# EAGLE design OpenEVSE_PLUS_v2.5 (EAGLE 7.3.0)
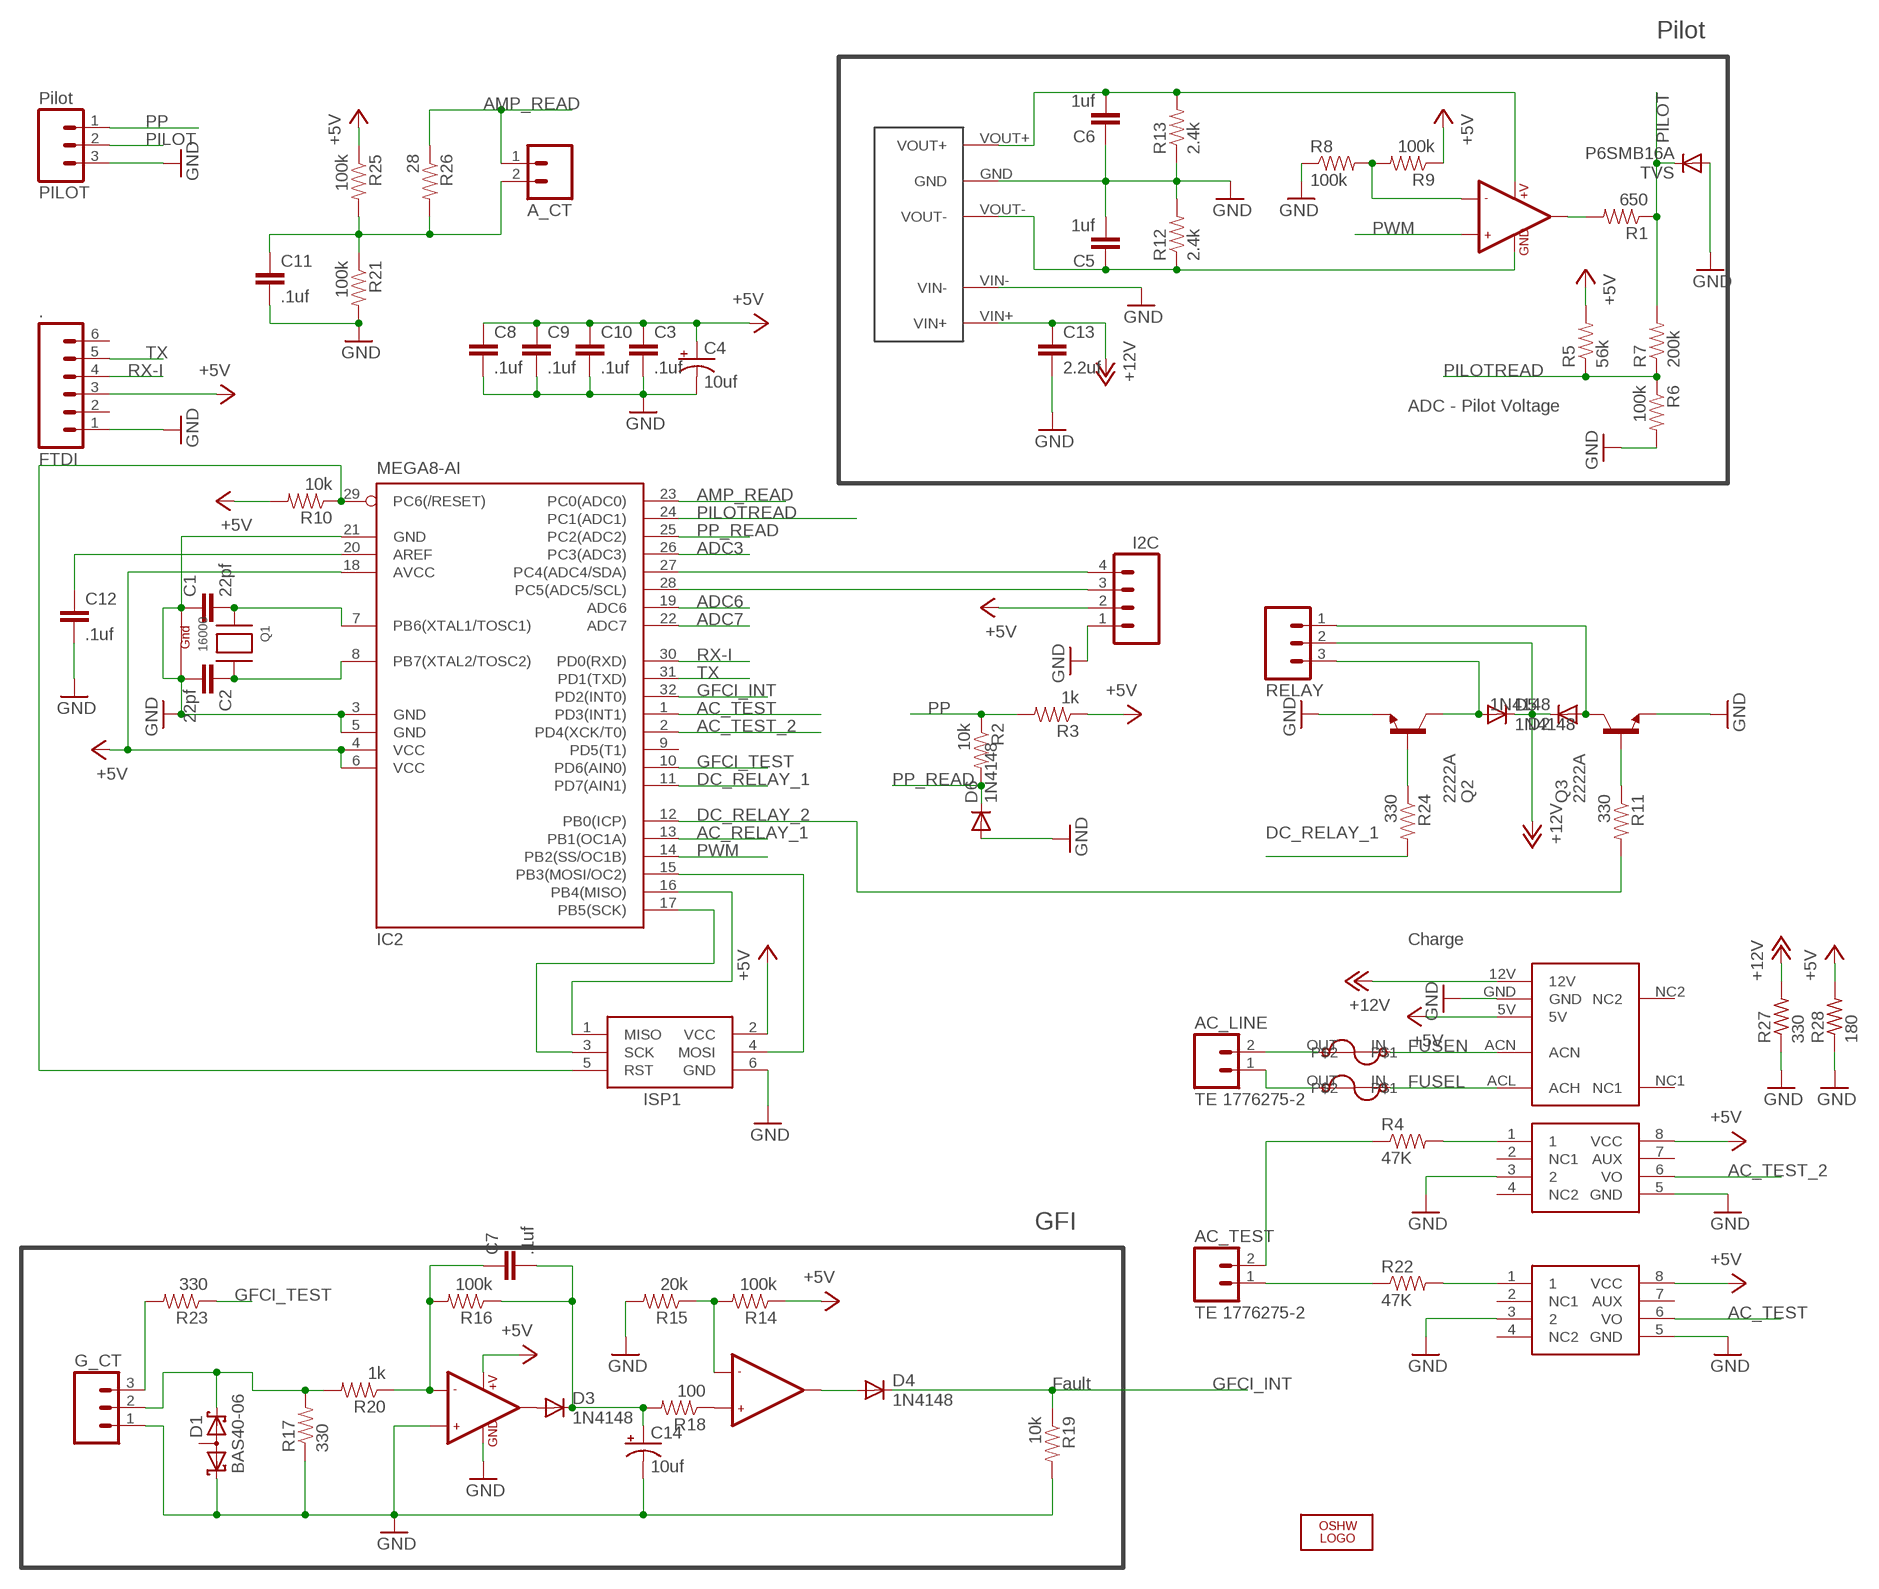
[diagram p0: schematic, sheet 1]

## Parts
.  FTDI  M06LOCK  [1X06_LOCK]
A_CT  M02PTH  [1X02]
AC_LINE  TE 1776275-2  M023.5MM_LOCK  [SCREWTERMINAL-3.5MM-2_LOCK]
AC_TEST  TE 1776275-2  M023.5MM_LOCK  [SCREWTERMINAL-3.5MM-2_LOCK]
C1  22pf  CAP0805  [0805]
C2  22pf  CAP0805  [0805]
C3  .1uf  CAP0805  [0805]
C4  10uf  CAP_POL1206  [EIA3216]
C5  1uf  CAP0805  [0805]
C6  1uf  CAP0805  [0805]
C7  .1uf  CAP0805  [0805]
C8  .1uf  CAP0805  [0805]
C9  .1uf  CAP0805  [0805]
C10  .1uf  CAP0805  [0805]
C11  .1uf  CAP0805  [0805]
C12  .1uf  CAP0805  [0805]
C13  2.2uf  CAP0805  [0805]
C14  10uf  CAP_POL1206  [EIA3216]
D1  BAS40-06  [SOT23]
D2  1N4148  DIODE-SOD123  [SOD123]
D3  1N4148  DIODE-SOD123  [SOD123]
D4  1N4148  DIODE-SOD123  [SOD123]
D5  1N4148  DIODE-SOD123  [SOD123]
D6  1N4148  DIODE-SOD123  [SOD123]
DCDC  D107E  DCDC_SIP  [DCDC_SIP]
F1  BEL1AFUSE  [BELFUSE1A]
F2  BEL1AFUSE  [BELFUSE1A]
G_CT  M03LOCK  [1X03_LOCK]
I2C  M04LOCK  [1X04_LOCK]
IC1  MID400  [DIP08]
IC2  MEGA8-AI  [TQFP32-08]
IC3  LMV358  [SO08]
IC4  LMV358  [SO08]
IC6  MID400  [DIP08]
ISP1  AVRISP-6  [AVRISP]
LOGO1  OSHW_LOGO_8MILX0150-NT  [OSHW_8X150_NOTEXT]
PILOT  Pilot  M03SCREW_LOCK  [SCREWTERMINAL-3.5MM-3_LOCK.007S]
Q1  16000  XTAL-4-3225  [NX3225]
Q2  2222A  BCX70SMD  [SOT23]
Q3  2222A  BCX70SMD  [SOT23]
R1  650  RESISTOR0805-RES  [0805]
R2  10k  RESISTOR0805-RES  [0805]
R3  1k  RESISTOR0805-RES  [0805]
R4  47K  RESISTORPTH-1/4W  [AXIAL-0.4]
R5  56k  RESISTOR0805-RES  [0805]
R6  100k  RESISTOR0805-RES  [0805]
R7  200k  RESISTOR0805-RES  [0805]
R8  100k  RESISTOR0805-RES  [0805]
R9  100k  RESISTOR0805-RES  [0805]
R10  10k  RESISTOR0805-RES  [0805]
R11  330  RESISTOR0805-RES  [0805]
R12  2.4k  RESISTOR0805-RES  [0805]
R13  2.4k  RESISTOR0805-RES  [0805]
R14  100k  RESISTOR0805-RES  [0805]
R15  20k  RESISTOR0805-RES  [0805]
R16  100k  RESISTOR0805-RES  [0805]
R17  330  RESISTOR0805-RES  [0805]
R18  100  RESISTOR0805-RES  [0805]
R19  10k  RESISTOR0805-RES  [0805]
R20  1k  RESISTOR0805-RES  [0805]
R21  100k  RESISTOR0805-RES  [0805]
R22  47K  RESISTORPTH-1/4W  [AXIAL-0.4]
R23  330  RESISTOR0805-RES  [0805]
R24  330  RESISTOR0805-RES  [0805]
R25  100k  RESISTOR0805-RES  [0805]
R26  28  RESISTOR0805-RES  [0805]
R27  330  R-US_R1206  [R1206]
R28  180  R-US_R1206  [R1206]
RELAY  M03SCREW_LOCK  [SCREWTERMINAL-3.5MM-3_LOCK.007S]
TVS  P6SMB16A  DIODE-SMB  [SMB]
U$1  MPM-04E-1205  [MPM-04E-1205]

## Nets
12V: C6.2 DCDC.VOUT+ IC4.8(+V) R13.2
+5V: ..3 C3.1 C4.A(+) C8.1 C9.1 C10.1 I2C.2 IC1.8(VCC) IC2.4(VCC) IC2.6(VCC) IC2.18(AVCC) IC3.8(+V) IC6.8(VCC) ISP1.2(VCC) R3.1 R5.2 R9.1 R10.2 R14.1 R25.1 R28.2 U$1.5V
+12V: C13.1 D2.C D5.C DCDC.VIN+ R27.2 RELAY.2 U$1.12V
-12V: C5.1 DCDC.VOUT- IC4.4(GND) R12.1
AC_RELAY_1: IC2.13(PB1(OC1A))
AC_TEST: IC2.1(PD3(INT1)) IC6.6(VO)
AC_TEST_2: IC1.6(VO) IC2.2(PD4(XCK/T0))
ADC3: IC2.26(PC3(ADC3))
ADC6: IC2.19(ADC6)
ADC7: IC2.22(ADC7)
AMP_READ: A_CT.1 IC2.23(PC0(ADC0)) R26.1
DC_RELAY_1: IC2.11(PD7(AIN1)) R24.2
DC_RELAY_2: IC2.12(PB0(ICP)) R11.2
FUSEL: F2.IN U$1.ACL(ACH)
FUSEN: F1.IN U$1.ACN
GFCI_INT: D4.C IC2.32(PD2(INT0)) R19.1
GFCI_TEST: IC2.10(PD6(AIN0)) R23.1
GND: ..1 C1.1 C2.2 C3.2 C4.C(-) C5.2 C6.1 C8.2 C9.2 C10.2 C11.2 C12.2 C13.2 C14.C(-) D1.1(K1) D6.A DCDC.GND DCDC.VIN- G_CT.1 I2C.1 IC1.3 IC1.5(GND) IC2.3(GND) IC2.5(GND) IC2.21(GND) IC3.3(+IN1) IC3.4(GND) IC6.3 IC6.5(GND) ISP1.6(GND) PILOT.3 Q1.1(G1) Q1.3(G2) Q2.2(E) Q3.2(E) R6.2 R8.1 R12.2 R13.1 R15.2 R17.1 R19.2 R21.2 R27.1 R28.1 TVS.A U$1.GND
N$1: D2.A Q3.3(C) RELAY.1
N$2: Q3.1(B) R11.1
N$4: C1.2 IC2.7(PB6(XTAL1/TOSC1)) Q1.2(X1)
N$5: C2.1 IC2.8(PB7(XTAL2/TOSC2)) Q1.4(X2)
N$6: D5.A Q2.3(C) RELAY.3
N$7: A_CT.2 C11.1 R21.1 R25.2 R26.2
N$8: C7.1 IC3.2(-IN1) R16.2 R20.1
N$9: IC1.1 R4.P$2
N$10: IC4.2(-IN1) R8.2 R9.2
N$11: IC4.1(OUT1) R1.2
N$12: AC_LINE.1 F2.OUT
N$13: AC_LINE.2 F1.OUT
N$14: IC2.15(PB3(MOSI/OC2)) ISP1.4(MOSI)
N$15: IC2.17(PB5(SCK)) ISP1.3(SCK)
N$16: IC2.16(PB4(MISO)) ISP1.1(MISO)
N$17: AC_TEST.2 R4.P$1
N$19: IC6.1 R22.P$2
N$20: D1.2(K2) G_CT.2 R17.2 R20.2
N$21: D3.A IC3.1(OUT1)
N$22: G_CT.3 R23.2
N$23: C7.2 C14.A(+) D3.C R16.1 R18.2
N$24: IC3.6(-IN2) R14.2 R15.1
N$25: D4.A IC3.7(OUT2)
N$26: IC3.5(+IN2) R18.1
N$29: AC_TEST.1 R22.P$1
N$30: Q2.1(B) R24.1
N$39: I2C.4 IC2.27(PC4(ADC4/SDA))
N$40: I2C.3 IC2.28(PC5(ADC5/SCL))
N$44: C12.1 IC2.20(AREF)
PILOT: PILOT.2 R1.1 R7.2 TVS.C
PILOTREAD: IC2.24(PC1(ADC1)) R5.1 R6.1 R7.1
PP: PILOT.1 R2.1 R3.2
PP_READ: D6.C IC2.25(PC2(ADC2)) R2.2
PWM: IC2.14(PB2(SS/OC1B)) IC4.3(+IN1)
RST: IC2.29(PC6(/RESET)) ISP1.5(RST) R10.1
RX-I: ..4 IC2.30(PD0(RXD))
TX: ..5 IC2.31(PD1(TXD))
Unconnected: ..2 ..6 D1.3(AA) IC1.2(NC1) IC1.4(NC2) IC1.7(AUX) IC2.9(PD5(T1)) IC4.5(+IN2) IC4.6(-IN2) IC4.7(OUT2) IC6.2(NC1) IC6.4(NC2) IC6.7(AUX) U$1.NC1 U$1.NC2

## Notes on the sheet
- Pilot
- ADC - Pilot Voltage
- Charge
- GFI
- Fault

## Library data of the parts
. = SparkFun:M06: Header 6 Standard 6-pin 0.1" header. Use with straight break away headers (SKU : PRT-00116), right angle break away headers (PRT-00553), swiss pins (PRT-00743), machine pins (PRT-00117), and female headers (PRT-00115). Molex polarized connector foot print use with SKU : PRT-08094 with associated crimp pins and housings. NOTES ON THE VARIANTS LOCK and LOCK_LONGPADS... This footprint was designed to help hold the alignment of a through-hole component (i.e. 6-pin header) while soldering it into place. You may notice that each hole has been shifted either up or down by 0.005 of an inch from it's more standard position (which is a perfectly straight line). This slight alteration caused the pins (the squares in the middle) to touch the edges of the holes. Because they are alternating, it causes a "brace" to hold the component in place. 0.005 has proven to be the perfect amount of "off-center" position when using our standard breakaway headers. Although looks a little odd when you look at the bare footprint, once you have a header in there, the alteration is very hard to notice. Also, if you push a header all the way into place, it is covered up entirely on the bottom side. This idea of altering the position of holes to aid alignment will be further integrated into the Sparkfun Library for other footprints. It can help hold any component with 3 or more connection pins.
A_CT AC_LINE AC_TEST = SparkFun:M02: Header 2 Standard 2-pin 0.1" header. Use with straight break away headers (SKU : PRT-00116), right angle break away headers (PRT-00553), swiss pins (PRT-00743), machine pins (PRT-00117), and female headers (PRT-00115). Molex polarized connector foot print use with SKU : PRT-08233 with associated crimp pins and housings.
C1-C3 C5-C13 = SparkFun:CAP: Capacitor Standard 0603 ceramic capacitor, and 0.1" leaded capacitor.
C4 C14 = SparkFun:CAP_POL: Capacitor Polarized These are standard SMD and PTH capacitors. Normally 10uF, 47uF, and 100uF in electrolytic and tantalum varieties. Always verify the external diameter of the through hole cap, it varies with capacity, voltage, and manufacturer. The EIA devices should be standard.
D1 = diode:BAS40-06: Silicon Schottky Diodes General-purpose diode for high-speed switching
D2-D6 TVS = diode:DIODE-: DIODE
DCDC = Qxd:DCDC_SIP
F1 F2 = Qxd:BEL1AFUSE
G_CT PILOT RELAY = SparkFun:M03: Header 3 Standard 3-pin 0.1" header. Use with straight break away headers (SKU : PRT-00116), right angle break away headers (PRT-00553), swiss pins (PRT-00743), machine pins (PRT-00117), and female headers (PRT-00115). Molex polarized connector foot print use with SKU : PRT-08232 with associated crimp pins and housings.
I2C = SparkFun:M04: Header 4 Standard 4-pin 0.1" header. Use with straight break away headers (SKU : PRT-00116), right angle break away headers (PRT-00553), swiss pins (PRT-00743), machine pins (PRT-00117), and female headers (PRT-00115). Molex polarized connector foot print use with SKU : PRT-08231 with associated crimp pins and housings.
IC1 IC6 = SparkFun:MID400
IC2 = atmel:MEGA8: MICROCONTROLLER 8 Kbytes FLASH, 1 kbytes SRAM, 512 bytes EEPROM, USART, 6-channel 10 bit ADC, 2-channel 8 bit ADC Pin compatible with Atmega48, ATMega88, ATMega168 Source: avr.lbr; MPN: ATMEGA8-16AU; OC_FARNELL: 9171371; OC_NEWARK: 73M8863
IC3 IC4 = SparkFun:LMV358
ISP1 = adafruit:AVRISP: AVR ISP HEADER Standard 6 pin header for AVR programming
LOGO1 = ohw-logo:OSHW_LOGO_8MIL
Q1 = adafruit:XTAL-4: Classic 4-pin 3.2 x 2.5mm crystal
Q2 Q3 = transistor-npn:BCX70*: NPN Transistor
R1-R26 = SparkFun:RESISTOR: Resistor Basic schematic elements and footprints for 0603, 1206, and PTH resistors.
R27 R28 = rcl:R-US_: RESISTOR, American symbol
U$1 = Qxd:MPM-04E-1205

## Board
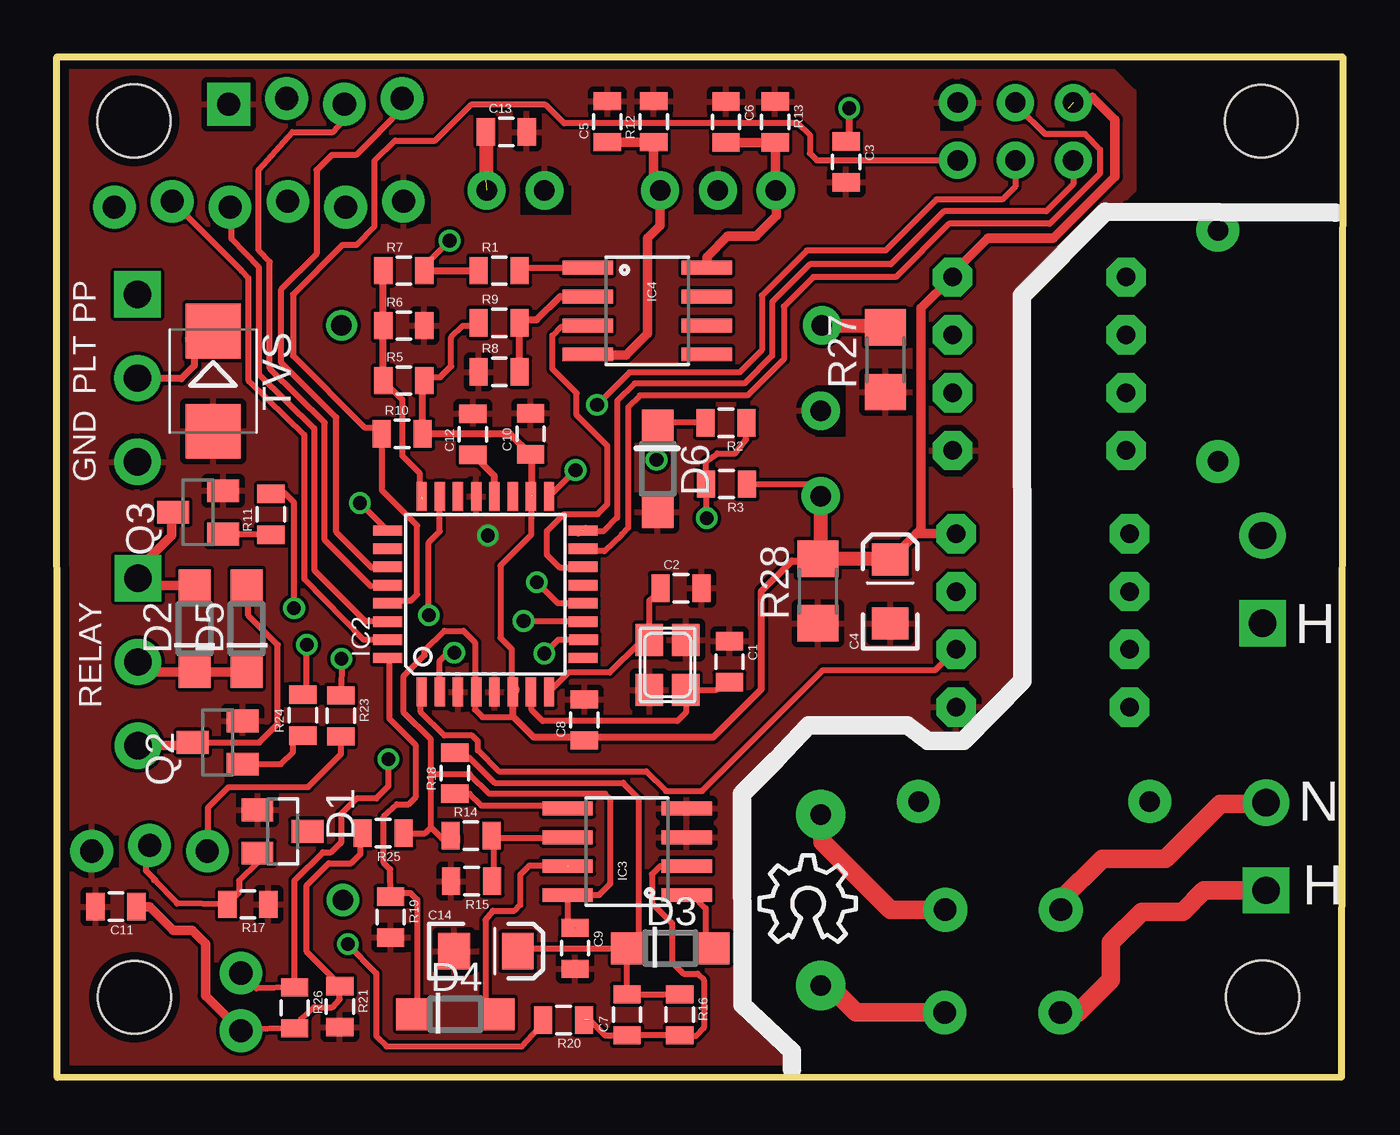
[diagram p1: board, top side]
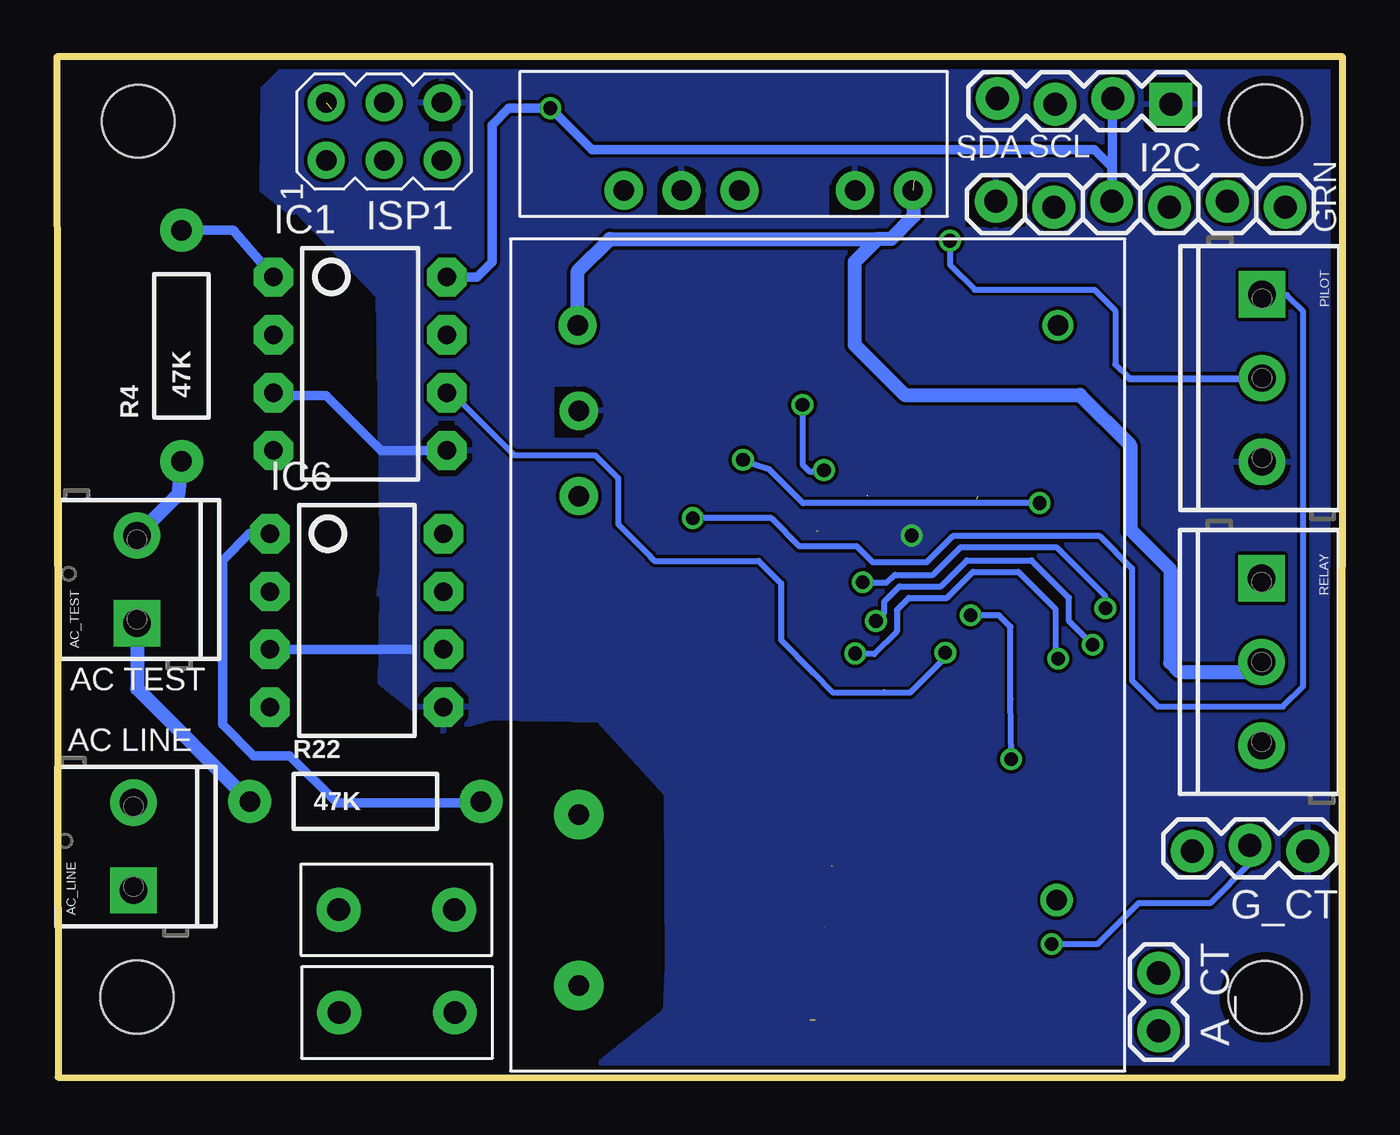
[diagram p2: board, bottom side, seen from below]

Size 56.48 x 44.85 mm. Coordinates in mm from the lower left corner, seen from the top.
Outline: 56.48,44.85 56.43,0.03 0.02,0 0,44.85 56.48,44.85
Copper layers (1*16): Top 0.0356mm / dielectric 1.5011mm / Bottom 0.0356mm
Design rules "default": minimum track width 6mil, minimum drill 13mil, track to track 6mil, track to pad 6mil, pad to pad 6mil, via to via 6mil, smd to smd 6mil, copper to edge 15mil, drill to drill 6mil, minimum pad ring 7mil, minimum via ring 7mil, stop-mask expansion 4mil, vias tented up to drill 0mil, thermal gap 10mil
Holes 3.2 mm at 52.91,42.03 52.97,3.55 3.41,3.53 3.38,42.04
tRestrict: area 38.8,41.6 to 39.8,42.4; area 3.2,25.9 to 3.9,28.3; area 7.2,41.6 to 7.9,43.9; area 39.2,43.2 to 40,43.8; area 39.1,16.2 to 39.8,16.9; area 39.1,16.8 to 40.1,17.4; area 1.8,9.2 to 2.7,10.6; area 14,37.5 to 16.4,38.7; area 20.4,37.9 to 22.6,39.2; area 28,37.9 to 30.1,39.2; area 33.3,28.2 to 34.7,30.4; area 39,27.9 to 39.8,28.7; 1 more areas
bRestrict: area 39.1,41.6 to 40.1,42.3; area 3.2,25.9 to 3.9,28.3; area 7.2,41.6 to 7.9,44; area 39.3,43.4 to 40,43.8; area 39.2,16.5 to 39.9,17.4; area 1.8,9.4 to 2.7,10.5; area 13.9,37.4 to 16.5,38.7; area 20.4,37.9 to 22.5,39.2; area 28,37.8 to 30.1,39.2; area 33.3,28.1 to 34.6,30.4; area 39,26.4 to 39.7,27.3; area 39,28 to 39.7,28.9

### Footprints (pad centres in the part's own frame; a part is rotated, then mirrored left to right if it is on the bottom)
1X06_LOCK = drill 1.016 pad 1.88: 1 0,0; 2 2.54,-0.254; 3 5.08,0; 4 7.62,-0.254; 5 10.16,0; 6 12.7,-0.254
1X02 = drill 1.016 pad 1.88: 1 0,0; 2 2.54,0
SCREWTERMINAL-3.5MM-2_LOCK = drill 1.2 pad 2.032 square: 1 -0.178,0 | drill 1.2 pad 2.032: 2 3.678,0
0805 = smd 0.8 x 1.2: 1 -0.9,0; 2 0.9,0
EIA3216 = smd 1.4 x 1.6: A 1.4,0; C -1.4,0
SOT23 = smd 1 x 1.4: 1 -0.95,-1.1; 2 0.95,-1.1; 3 0,1.1
SOD123 = smd 1.4 x 1.4: A 1.9,0; C -1.9,0
DCDC_SIP = drill 0.9 pad 1.676: GND 10.16,0; VIN+ 0,0; VIN- 2.54,0; VOUT+ 12.7,0; VOUT- 7.62,0
BELFUSE1A = drill 1 pad 1.93: IN 2,1.66; OUT 2,6.74
1X03_LOCK = drill 1.016 pad 1.88: 1 0,0.127; 2 2.54,-0.127; 3 5.08,0.127
1X04_LOCK = drill 1.016 pad 1.88 square: 1 0,0.127 | drill 1.016 pad 1.88: 2 2.54,-0.127; 3 5.08,0.127; 4 7.62,-0.127
DIP08 = drill 0.813 pad 1.727 octagon: 1 -3.81,-3.81; 2 -1.27,-3.81; 3 1.27,-3.81; 4 3.81,-3.81; 5 3.81,3.81; 6 1.27,3.81; 7 -1.27,3.81; 8 -3.81,3.81
TQFP32-08 = smd 1.27 x 0.457: 1 -4.293,2.8; 2 -4.293,2; 3 -4.293,1.2; 4 -4.293,0.4; 5 -4.293,-0.4; 6 -4.293,-1.2; 7 -4.293,-2; 8 -4.293,-2.8; 17 4.293,-2.8; 18 4.293,-2; 19 4.293,-1.2; 20 4.293,-0.4; 21 4.293,0.4; 22 4.293,1.2; 23 4.293,2; 24 4.293,2.8 | smd 0.457 x 1.27: 9 -2.8,-4.293; 10 -2,-4.318; 11 -1.2,-4.293; 12 -0.4,-4.293; 13 0.4,-4.293; 14 1.2,-4.293; 15 2,-4.293; 16 2.8,-4.293; 25 2.8,4.293; 26 2,4.293; 27 1.2,4.293; 28 0.4,4.293; 29 -0.4,4.293; 30 -1.2,4.293; 31 -2,4.293; 32 -2.8,4.293
SO08 = smd 0.61 x 2.21: 1 -1.905,-2.616; 2 -0.635,-2.616; 3 0.635,-2.616; 4 1.905,-2.616; 5 1.905,2.616; 6 0.635,2.616; 7 -0.635,2.616; 8 -1.905,2.616
AVRISP = drill 0.9 pad 1.626: 1 -1.27,2.54; 2 1.27,2.54; 3 -1.27,0; 4 1.27,0; 5 -1.27,-2.54; 6 1.27,-2.54
SCREWTERMINAL-3.5MM-3_LOCK.007S = drill 1.2 pad 2.032 square: 1 -0.178,0 | drill 1.2 pad 2.032: 2 3.5,0; 3 7.178,0
NX3225 = smd 1.4 x 1.2: 1 -1.1,0.8; 2 1.1,0.8; 3 1.1,-0.8; 4 -1.1,-0.8
AXIAL-0.4 = drill 0.9 pad 1.88: P$1 -5.08,0; P$2 5.08,0
R1206 = smd 1.6 x 1.803: 1 -1.422,0; 2 1.422,0
SMB = smd 2.4 x 2.4: A 2.2,0; C -2.2,0
MPM-04E-1205 = drill 0.9 pad 1.676: 5V 3,25.25; 12V 2.95,32.75; GND 3,29 | drill 0.9 pad 2.184: ACL 3,3.75; ACN 3,11.25 | drill 0.9 pad 1.422: NC1 24,7.5 | drill 0.9: NC2 24.05,32.75

### Placement (x,y rotation side)
.  15.22,38.51 0 bottom
A_CT  8.08,4.6 270 bottom
AC_LINE  53.12,8.41 90 bottom
AC_TEST  52.96,20.14 90 bottom
C1  29.55,18.28 270 top
C2  27.42,21.52 0 top
C3  34.68,40.24 270 top
C4  36.61,21.36 90 top
C5  24.19,42.01 90 top
C6  29.39,41.99 270 top
C7  25.05,2.77 90 top
C8  23.17,15.72 90 top
C9  22.76,5.69 270 top
C10  20.81,28.3 90 top
C11  2.6,7.52 180 top
C12  18.28,28.27 90 top
C13  19.74,41.56 0 top
C14  18.85,5.56 0 top
D1  9.91,10.82 270 top
D2  6.05,19.74 90 top
D3  26.95,5.69 0 top
D4  17.51,2.8 0 top
D5  8.34,19.74 90 top
D6  26.4,26.75 270 top
DCDC  18.88,38.99 180 bottom
F1  37.37,5.39 90 bottom
F2  37.34,0.87 90 bottom
G_CT  1.53,10.09 180 bottom
I2C  7.55,42.9 180 bottom
IC1  43.16,31.37 270 bottom
IC2  18.82,21.25 90 top
IC3  25.05,9.93 90 top
IC4  25.93,33.69 270 top
IC6  43.31,20.09 270 bottom
ISP1  42.11,41.58 90 bottom
LOGO1  30.87,5.97 0 top
PILOT  3.54,34.24 270 bottom
Q1  26.83,18.14 270 top
Q2  7.07,14.73 90 top
Q3  6.2,24.84 90 top
R1  19.43,35.46 0 top
R2  29.39,28.78 180 top
R3  29.42,26.09 180 top
R4  51.01,32.16 90 bottom
R5  15.24,30.63 0 top
R6  15.24,33.05 0 top
R7  15.24,35.46 0 top
R8  19.43,31.02 0 top
R9  19.43,33.17 0 top
R10  15.17,28.29 0 top
R11  9.4,24.76 90 top
R12  26.22,42.01 90 top
R13  31.55,41.99 270 top
R14  18.19,10.64 0 top
R15  18.22,8.64 180 top
R16  27.36,2.77 270 top
R17  8.39,7.62 180 top
R18  17.48,13.39 90 top
R19  14.66,7.06 270 top
R20  22.26,2.54 180 top
R21  12.43,3.13 270 top
R22  42.93,12.14 0 bottom
R23  12.48,15.9 270 top
R24  10.8,15.93 90 top
R25  14.33,10.75 180 top
R26  10.44,3.08 270 top
R27  36.4,31.55 90 top
R28  33.43,21.39 90 top
RELAY  3.56,21.77 270 bottom
TVS  6.86,30.61 270 top
U$1  36.56,0.31 0 bottom

### Tracks (layer width: path | path; a pad name or v marks a point on that pad's centre or on a via)
12V
  Top 0.254: 31.58,41.07 31.49,41.15 R13.2
  Top 0.305: 31.58,41.07 31.42,41.18
  Top 0.406: C6.2 R13.2 31.58,41.07 DCDC.VOUT+ 31.6,38.97 31.6,37.87 30.71,36.98 29.47,36.98 28.55,36.07 IC4.8
+5V  (via drill 0.6)  (4 unrouted)
  Top 0.254: R5.2 16.14,30.78 16.84,30.78 17.33,31.27 17.33,32.54 17.84,33.05 18.6,33.05 18.6,33.11 R9.1 | 20.88,25.6 IC2.18 20.82,23.84 19.49,22.51 19.49,19.33 19.99,18.82 19.99,16.92 | 17.52,10.35 R14.1 17.32,10.49 16.92,10.52 16.44,11 | C9.1 22.43,6.91 IC3.8 23.83,8.03 23.83,8.05 24.31,8.54 24.31,12.24 24.08,12.47 19,12.47 18.14,13.34 16.64,13.34 16.62,13.31 16.51,13.41 | 20.12,16.54 20.12,16.85 IC2.6 | 44.4,42.5 44.4,42.59 | 16.51,13.41 16.44,13.49 | 45.5,43.08 45.17,43.08 | 16.44,13.34 16.44,14.86 15.22,16.08 15.22,17.63 16.16,18.57 16.16,18.77 17.02,19.64 17.86,19.64 18.37,19.13 18.37,16.36 | 16.44,11 16.44,13.34 | 16.44,13.34 16.51,13.41 | R25.1 16.18,10.75 16.44,11 | 30.28,26.27 R3.1 33.02,26.09 U$1.5V | C8.1 23.17,14.89 23.25,14.96 | 18.37,17.01 IC2.4 18.42,16.41 18.37,16.36 | 18.37,16.36 18.37,16.18 18.7,15.85 20.02,15.85 20.05,15.88 | 39.25,35.28 IC1.8
  Top 0.305: 20.07,16.91 IC2.6 20.05,16.93 20.05,15.88 20.96,14.96 23.25,14.96 28.83,14.96 30.94,17.07 30.94,21.36 32.29,22.71 33.33,22.71 R28.2 | R5.2 16.07,30.56 R10.2 19.91,28.29 C10.1 20.88,27.32 20.88,25.55 | v34.8,42.6 34.8,41.27 C3.1
  Top 0.406: IC2.6 20.12,17.05 | 20.12,17.05 19.99,16.92 | 17.52,10.35 17.52,10.61 | 45.5,43.08 46.49,42.09 46.49,39.6 43.77,36.88 40.9,36.88 39.35,35.33 IC1.8 37.95,33.81 37.95,24.1 37.75,23.9 | 45.17,43.08 44.88,43.08 ISP1.2 | 37.75,23.9 C4.A | IC6.8 37.75,23.9
  Top 0.61: C4.A 36.39,22.81 R28.2 33.56,22.94 U$1.5V
  Bottom 0.406: I2C.2 10.11,43.03 10.11,38.54 ..3 10.14,40.01 10.9,40.77 32.97,40.77 v34.8,42.6 36.63,42.6 37.37,41.86 37.37,35.84 38.03,35.18 IC1.8
+12V  (1 unrouted)
  Top 0.254: C13.1 18.84,41.47 18.93,41.33
  Top 0.406: 18.93,41.33 18.75,41.71 18.85,41.81 | D5.C D2.C 3.99,17.84 RELAY.2
  Top 0.61: U$1.12V 35.91,33.06 R27.2 | DCDC.VIN+ 18.88,41.52 C13.1
  Bottom 0.61: U$1.12V 33.61,35.44 32.19,36.86 20.43,36.86 | 18.88,39.5 18.83,39.45 18.83,37.87 19.84,36.86 20.43,36.86 | 20.43,36.86 21.44,35.84 21.44,32.21 19.23,30 11.54,30 9.33,27.79 9.33,24.08 7.57,22.33 7.57,18.24 7.17,17.84 3.99,17.84 RELAY.2
-12V
  Top 0.254: 26.15,41.11 R12.1
  Top 0.305: 26.15,41.11 26.22,41.18 R12.1
  Top 0.406: C5.1 R12.1 26.22,39.27 DCDC.VOUT- 26.5,37.44 25.94,36.88 25.94,32.69 25,31.75 23.35,31.75 IC4.4
AC_TEST
  Top 0.254: IC6.6 38.59,17.91 33.66,17.91 28.35,12.6 26.75,12.6 25.89,13.46 19.41,13.46 18.5,14.38 18.5,14.78 18.24,15.04 17.02,15.04 15.98,16.08 15.98,16.91 IC2.1
AC_TEST_2  (via drill 0.6)
  Top 0.254: v17.45,18.67 17.07,18.57 16.79,18.29 16.79,16.98 IC2.2
  Top 0.305: 16.79,16.91 IC2.2
  Bottom 0.254: IC1.6 39.15,30.1 36.4,27.36 32.85,27.36 31.83,26.34 31.83,24.34 30.41,22.91 30.41,22.89 30.23,22.71 25.66,22.71 24.67,21.72 24.67,19.23 23.27,17.81 22.38,16.92 19,16.92 17.45,18.47 v17.45,18.67
AMP_READ  (via drill 0.6)
  Top 0.254: A_CT.1 8.76,3.92 R26.1 10.45,8.66 11.69,9.91 12.04,9.91 12.45,10.29 12.48,10.31 12.48,11.58 13.16,12.27 14.03,12.27 14.56,12.8 v14.56,14 | v16.34,20.32 16.34,23.52 16.82,24.01 IC2.23
  Bottom 0.254: v14.56,14 14.59,16.66 14.59,19.81 15.09,20.32 v16.34,20.32
DC_RELAY_1  (via drill 0.6)
  Top 0.254: IC2.11 20.53,20.05 v20.5,20.07 | R24.2 10.98,16.89 v10.98,19.03
  Bottom 0.254: v10.98,19.03 12.02,20.07 12.02,21.08 13.67,22.73 16.51,22.73 17.66,21.59 19.46,21.59 20.15,20.91 20.15,20.42 v20.5,20.07
DC_RELAY_2  (via drill 0.6)
  Top 0.254: IC2.12 22.01,20.85 v21.09,21.77 | v10.42,20.63 10.42,25.28 9.99,25.71 9.45,25.71 R11.2
  Bottom 0.254: v21.09,21.77 20.02,21.77 19.66,22.1 17.99,22.1 16.77,23.32 12.58,23.32 10.45,21.19 10.45,20.65 v10.42,20.63
FUSEL
  Top 0.813: U$1.ACL 33.92,4.06 35.11,2.87 F2.IN
FUSEN
  Top 0.813: F1.IN 36.61,7.39 33.64,10.36 33.64,11.3 U$1.ACN
GFCI_INT
  Top 0.254: 16.01,2.79 D4.C 15.83,3.02 15.83,7.82 15.55,8.1 14.8,8.1 R19.1 14.65,9.16 14.36,9.45 14.36,11.48 14.94,12.02 15.45,12.02 15.75,12.32 15.75,14.63 14.61,15.77 14.61,18.37 IC2.32 14.51,18.42
GFCI_TEST  (via drill 0.6)
  Top 0.254: IC2.10 22.02,19.25 v21.42,18.64 | v12.5,18.42 R23.1
  Bottom 0.254: v21.42,18.64 21.39,18.62 20.58,18.62 19.59,19.61 19.59,20.55 19.05,21.08 17.38,21.08 16.24,22.23 14.26,22.23 12.63,20.6 12.63,18.54 v12.5,18.42
GND  (via drill 0.6)
  Top 0.254: C14.C 17.83,5.16
  Bottom 0.406: IC6.3 40.95,18.82 | IC1.5 42.25,27.56 44.66,29.97 46.84,29.97 IC1.3
  other vias: 18.93,23.83
  pour Top: 0.03,44.99 3.28,45.1 46.2,44.36 46.27,44.36 47.3,43.33 47.3,39.02 46.97,38.69 46.87,38.69 46.54,38.36 46.2,38.05 42.27,34.34 42.37,17.5 39.83,14.75 38.33,14.73 37.24,15.72 32.96,15.68 30.05,12.42 30.03,3.09 32.7,0.1 0.06,0.03 -0.04,25.13 0.03,28.74
  pour Bottom: 0.31,45.05 46.38,44.49 47.43,43.44 47.48,39.02 46.21,38 45.95,38.13 42.35,34.34 42.17,22.4 42.32,21.24 42.22,21.44 42.19,21.08 42.27,17.38 39.58,15.24 37.4,15.84 32.68,15.74 29.7,12.5 29.67,4.9 29.74,2.92 32.59,0.69 32.35,0.03 17.1,0.06 6.75,-0.24 -0.23,0.16
  pour Top: -0.1,45.12 3.21,45.25 45.9,44.74 46.2,44.2 46.26,38.79 38.38,35.33 38.38,15.18 32.91,15.33 29.62,11.97 28.63,0.41 26.14,0.27 24.04,0.18 -0.07,0.16 -0.16,28.18 -0.1,28.87
N$1
  Top 0.406: D2.A 3.87,21.64 RELAY.1 3.56,22.35 5.03,23.83 5.03,24.77 Q3.3
N$2
  Top 0.254: Q3.1 9.37,23.89 R11.1
N$4
  Top 0.254: C1.2 28.94,17.04 Q1.2 27.63,16.04 27.26,15.67 21.34,15.67 20.86,16.16 20.86,16.92 IC2.7
N$5
  Top 0.254: Q1.4 26.03,20.97 26.34,21.24 26.34,21.34 C2.1 | Q1.4 26.12,19.11 | Q1.4 25.62,19.11 25.59,19.11 24.29,17.81 22.48,17.81 IC2.8
N$6
  Top 0.254: Q2.3 8.89,14.73 9.71,15.55 9.71,19.03 8.41,20.32 8.41,20.93 8.73,21.25
  Top 0.305: 8.73,21.25 D5.A
  Top 0.406: RELAY.3 5.82,14.59 Q2.3
N$7
  Top 0.254: R26.2 8.15,2.12 A_CT.2 | 10.45,2.1 R26.2 | R26.2 10.73,2.18 10.73,2.57 11.31,3.1 12.12,3.1 12.43,3.46 R21.1 12.49,4.03 10.98,5.54 10.98,8.46 11.94,9.42 12.93,9.42 13.34,9.83 13.34,10.65 R25.2
  Top 0.406: C11.1 4.07,7.52 5.11,6.48 5.95,6.48 6.53,5.89 6.53,3.61 A_CT.2
N$8  (1 unrouted)
  Top 0.254: R16.2 C7.1 | 27.34,1.75 27.34,1.84 R16.2 | 25.01,1.83 C7.1 | 23.4,2.54 24.08,1.86 25.04,1.86 C7.1 | IC3.2 26.5,9.3 26.14,8.94 26.14,7.67 27.03,6.78 27.03,5.08 27.54,4.57 28.15,4.57 28.43,4.29 28.43,2.19 28.07,1.83 27.4,1.83 R16.2
N$9
  Bottom 0.406: IC1.1 48.75,37.24 R4.P$2
N$10
  Top 0.305: 20.08,30.63 R8.2 R9.2 20.2,33.3 21.08,33.3 22.11,34.33 IC4.2
N$11
  Top 0.254: IC4.1 20.47,35.6 R1.2
N$12
  Top 0.813: AC_LINE.1 50.4,8.23 49.46,7.29 47.66,7.29 46.31,5.95 46.31,4.29 44.86,2.85 44.1,2.85 F2.OUT
N$13
  Top 0.813: F1.OUT 44.11,7.81 45.93,9.63 48.7,9.63 51.11,12.04 53.07,12.04 AC_LINE.2
N$14
  Top 0.254: 41.84,42.62 42.25,42.62 43.41,41.48 45.17,41.48 45.83,40.79 45.83,39.73 43.62,37.52 39.2,37.52 36.86,35.18 33.23,35.18 31.93,33.88 31.93,31.57 30.33,29.97 25.61,29.97 25.1,29.47 25.1,24.16 24.82,23.88 24.06,23.14 23.22,23.14 IC2.15 23.14,23.27 | 41.84,42.62 41.74,42.62 | ISP1.4 41.86,42.61 41.84,42.62
N$15  (via drill 0.6)
  Top 0.254: IC2.17 21.63,25.54 v22.79,26.7 | ISP1.3 42.11,39.16 41.53,38.58 38.64,38.58 36.4,36.35 32.95,36.35 30.97,34.37 30.97,31.98 29.98,30.99 25.15,30.99 v23.73,29.57
  Bottom 0.254: v23.73,29.57 23.73,26.95 23.42,26.65 22.84,26.65 v22.79,26.7
N$16  (1 unrouted)
  Top 0.254: 23.37,24.03 23.24,24.16 IC2.16 23.16,24.01 24.01,24.01 24.62,24.61 24.62,29.75 25.38,30.51 30.21,30.51 31.42,31.73 31.42,34.09 33.08,35.74 36.63,35.74 38.97,38.08 43.47,38.08 44.65,39.26 ISP1.1 | 23.04,24.03 22.92,23.9
N$17
  Bottom 0.61: R4.P$1 51.16,25.62 AC_TEST.2
N$19
  Bottom 0.406: IC6.1 48.04,23.9 49.21,22.73 49.21,15.52 47.83,14.15 46.26,14.15 44.18,12.07 37.93,12.07 R22.P$2
N$20  (via drill 0.6)
  Top 0.254: G_CT.2 3.92,10.19 3.92,9.09 4.32,8.69 4.27,8.69 5.27,7.66 R17.2 8.01,8.14 8.01,8.66 8.81,9.47 D1.2 | R20.2 21.36,2.4 20.43,1.37 14.48,1.37 14.03,1.83 14.03,4.6 v12.78,5.87
  Bottom 0.254: G_CT.2 4.07,9.42 5.82,7.67 8.97,7.67 10.78,5.87 v12.78,5.87
N$21
  Top 0.254: IC3.1 27.92,8.03 28.5,7.44 28.5,6.04 D3.A
N$22
  Top 0.254: R23.2 12.48,14.23 11.03,12.78 7.55,12.78 6.64,11.86 6.64,9.98 G_CT.3
N$23
  Top 0.254: 27.34,3.91 27.59,3.66 27.59,3.53 27.45,3.67 R16.1 C7.2 25.05,5.32 D3.C | C14.A 20.35,5.56 20.48,5.69 24.92,5.69 | 24.92,5.69 25.05,5.56 | 24.92,5.69 D3.C | D3.C 24.93,5.56 24.92,5.56 25.56,5.95 25.56,12.27 24.87,12.96 19.23,12.96 18.11,14.07 17.69,14.07 R18.2 17.39,14.29 17.35,14.33 | 17.35,14.33 17.3,14.33 | 17.35,14.33 17.81,14.33 17.94,14.2
N$24
  Top 0.254: 19.21,8.32 19.21,8.61 | 19.21,8.61 19.21,10.43 R14.2 19.26,10.54 22.31,10.54 IC3.6 | R15.1 19.18,8.64 19.21,8.61
  Top 0.406: R14.2 19.23,10.54 19.21,10.52
N$25  (1 unrouted)
  Top 0.254: D4.A 18.83,3.32 18.83,6.94 19.16,7.34 20.1,7.34 20.35,7.6 20.35,8.92 20.76,9.32 22.46,9.32
N$26
  Top 0.254: IC3.5 22.31,11.96 18.65,11.96 18.14,12.47 17.49,12.47 R18.1 17.55,12.42
N$29
  Bottom 0.61: AC_TEST.1 52.96,17.1 R22.P$1
N$30
  Top 0.254: Q2.1 9.85,13.78 10.37,14.3 10.37,14.93 R24.1
N$39
  Top 0.254: IC2.27 13.83,22.42 12.27,23.98 12.27,29.01 9.86,31.42 9.86,34.65 11.41,36.2 11.41,39.88 12.07,40.54 13.14,40.54 15.17,42.57 I2C.4
N$40
  Top 0.254: IC2.28 13.79,21.59 11.77,23.62 11.77,28.78 9.35,31.17 9.35,35.84 8.87,36.35 8.87,39.91 10.34,41.56 12.12,41.56 12.63,42.09 I2C.3
N$44
  Top 0.305: IC2.20 19.22,26.43 C12.1
PILOT  (via drill 0.6)
  Top 0.254: R7.2 16.14,35.67 v17.25,36.78
  Top 0.305: R7.2 R1.1 | 6.04,32.43 6.04,31.28 5.47,30.71 3.57,30.71 PILOT.2
  Top 0.406: 16.18,35.63 R7.2
  Top 0.813: TVS.C 6.04,32.43
  Bottom 0.254: v17.25,36.78 17.25,35.71 16.16,34.62 10.9,34.62 9.99,33.71 9.99,31.35 9.35,30.71
  Bottom 0.305: 9.35,30.71 3.57,30.71 PILOT.2
PILOTREAD  (1 unrouted)
  Top 0.254: 16.06,25.43 15.93,25.43 15.93,26.57 15.17,27.33 15.17,29.8 R5.1
  Top 0.305: R7.1 R6.1 R5.1
PP  (via drill 0.6)
  Top 0.254: v28.55,24.59 28.52,24.62 R3.2 28.52,27.07 29.01,27.43 29.8,27.43 30.28,28.04 30.28,28.59 R2.1
  Bottom 0.254: PILOT.1 3.51,34.39 2.44,34.39 1.73,33.68 1.73,17.2 2.62,16.31 8.11,16.31 9.25,17.45 9.25,22.38 10.67,23.8 17.12,23.8 18.27,22.66 20.65,22.66 21.34,23.34 23.86,23.34 25.1,24.59 v28.55,24.59
PP_READ  (via drill 0.6)
  Top 0.254: R2.2 26.57,28.78 D6.C 26.34,28.85 v26.34,27.15 | IC2.25 14.54,24.02 v13.31,25.25
  Bottom 0.254: v13.31,25.25 23.7,25.25 25.18,26.72 26.27,27.08 v26.34,27.15
PWM
  Top 0.254: IC4.3 23.26,33 22.15,33 21.77,32.62 21.77,31.14 22.84,30.07 22.84,29.11 24.19,27.76 24.19,25.2 23.75,24.77 22.28,24.77 21.54,24.03 21.52,24.03 21.52,22.99 22.08,22.43 23.1,22.43 IC2.14
RST
  Top 0.254: R10.1 14.28,28.28 14.28,25.81 15.83,24.26 15.83,21.24 15.55,20.96 14.64,20.96 IC2.29 | R10.1 14.27,28.34 14.28,28.35 | R10.1 | ISP1.5 33.38,40.31 33.08,40.62 33.08,41.43 32.57,41.94 22.28,41.94 21.47,42.75 18.19,42.75 16.62,41.18 14.86,41.18 13.95,40.29 13.95,37.42 13.16,36.6 12.55,36.6 10.37,34.42 10.37,31.73 13.52,28.58 13.98,28.58 R10.1
RX-I
  Top 0.254: IC2.30 13.57,20.05 11.31,22.3 11.31,28.53 8.87,30.91 8.87,35.61 7.68,36.86 7.68,38.18 ..4
TX
  Top 0.254: IC2.31 13.48,19.25 10.88,21.9 10.88,28.25 8.44,30.61 8.41,30.63 8.41,35.16 8.11,35.45 8.11,35.46 ..5

### Text on the board
tNames: PP | PLT | GND | _ | _ | H | RELAY | N | H | _ | _
bNames: SCL | SDA | GRN | AC TEST | AC LINE